# Altium project BusinessCard.PrjPcb
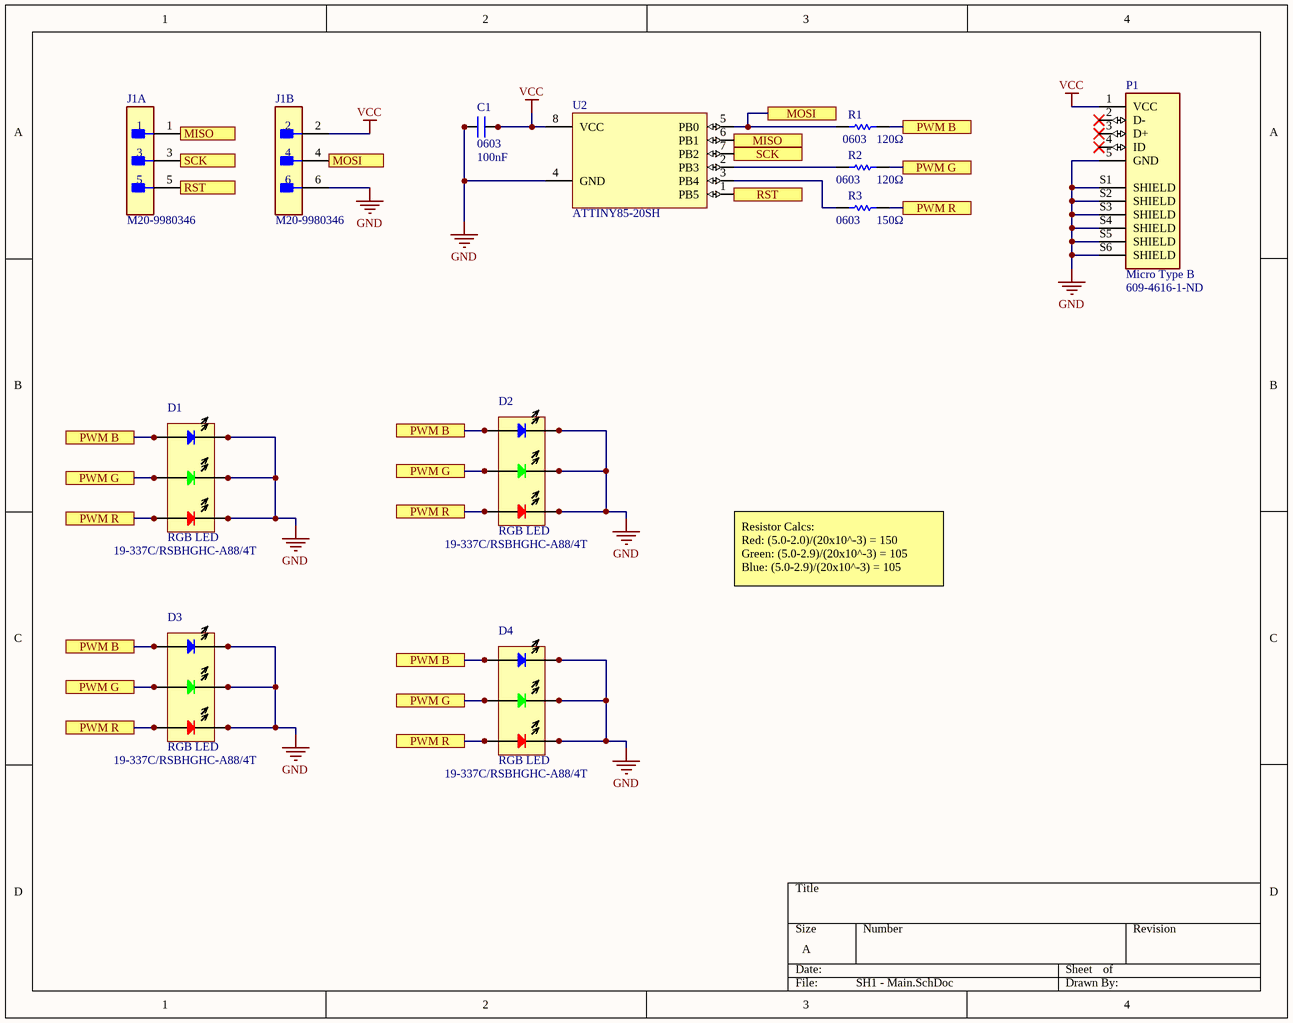
[diagram p0: SH1 - Main.SchDoc]
1 sheet, 11 parts. Net scope: flat (ports and power ports of the same name join across sheets).
Board file: PCB.PcbDoc

## Sheet SH1 - Main.SchDoc
size A; SheetNumber: 1; SheetTotal: 1

### Parts
C1  0603  Capacitance: 100nF  [0603]
D1  RGB LED  [19-337C/RSBHGHC-A88/4T]
D2  RGB LED  [19-337C/RSBHGHC-A88/4T]
D3  RGB LED  [19-337C/RSBHGHC-A88/4T]
D4  RGB LED  [19-337C/RSBHGHC-A88/4T]
J1  M20-9980346  [FP-M20-9980346-MFG]  (parts A,B of 2)
P1  Micro Type B  Supplier Part Number 1: 609-4616-1-ND  [FCI_10118193-0001LF]
R1  0603  Resistance: 120Ω  [SDR03EZPJ200]
R2  0603  Resistance: 120Ω  [SDR03EZPJ200]
R3  0603  Resistance: 150Ω  [0603]
U2  Manufacturer Part Number: ATTINY85-20SH  [SOIC127P798X216-8N]  (hidden comment: ATTiny85)

### Ports
MISO, MOSI, PWM B, PWM G, PWM R, RST, SCK

### Nets
GND: C1.1 D1.1(GREEN_-) D1.3(RED_-) D1.5(BLUE_-) D2.1(GREEN_-) D2.3(RED_-) D2.5(BLUE_-) D3.1(GREEN_-) D3.3(RED_-) D3.5(BLUE_-) D4.1(GREEN_-) D4.3(RED_-) D4.5(BLUE_-) J1.6 P1.5(GND) P1.S1(SHIELD) P1.S2(SHIELD) P1.S3(SHIELD) P1.S4(SHIELD) P1.S5(SHIELD) P1.S6(SHIELD) U2.4(GND)
VCC: C1.2 J1.2 P1.1(VCC) U2.8(VCC)
NetD1_2: D1.2(Green_+) D2.2(Green_+) D3.2(Green_+) D4.2(Green_+) R2.2 ; port PWM G
NetD1_4: D1.4(Red_+) D2.4(Red_+) D3.4(Red_+) D4.4(Red_+) R3.2 ; port PWM R
NetD1_6: D1.6(Blue_+) D2.6(Blue_+) D3.6(Blue_+) D4.6(Blue_+) R1.2 ; port PWM B
NetJ1_1: J1.1 U2.6(PB1) ; port MISO
NetJ1_3: J1.3 U2.7(PB2) ; port SCK
NetJ1_4: J1.4 R1.1 U2.5(PB0) ; port MOSI
NetJ1_5: J1.5 U2.1(PB5) ; port RST
NetR2_1: R2.1 U2.2(PB3)
NetR3_1: R3.1 U2.3(PB4)

Not connected (* = marked no-connect by the designer): P1 2(D-)* 3(D+)* 4(ID)*

### Notes on the sheet
- Resistor Calcs:
  Red: (5.0-2.0)/(20x10^-3) = 150
  Green: (5.0-2.9)/(20x10^-3) = 105
  Blue: (5.0-2.9)/(20x10^-3) = 105

### Library data of the parts
C1 = CAP 0.1uF: Ceramic Capacitor, Multilayer, Ceramic, 16V, 10% +Tol, 10% -Tol, X5R, 15% TC, 0.1uF, Surface Mount, 0603; Manufacturer: Taiyo Yuden; Manufacturer Part Number: EMK107BJ104KAHT; Multilayer: Yes; Reference Standard: AEC-Q200; Supplier 1: Digi-Key; RoHS: Yes; Category: Ceramic Capacitors; Stock 1: 65712; Mount: Surface Mount; Number of Pins: 2; Dielectric Material: Ceramic; Package Shape: Rectangular; Size Code: 0603; Min Operating Temperature: -55°C; Max Operating Temperature: 85°C; Capacitor Type: Ceramic; Negative Tolerance: 10%; Package Style: SMTMeter; Packaging: Tape and Reel; Positive Tolerance: 10%; Rated DC Voltage (URdc): 16V; Temperature Characteristics Code: X5R; Termination: Wraparound; Length: 1.6mm; Width: 0.8mm; Height: 0.8mm; ComponentLink1URL: https://datasheet.ciiva.com:443/pdfs/VipMasterIC/IC/TAIY/TAIY-S-A0009098652/TAIY-S-A0009098054-1.pdf?src-supplier=IHS+Markit; ComponentLink1Description: https://datasheet.ciiva.com:443/pdfs/VipMasterIC/IC/TAIY/TAIY-S-A0009098652/TAIY-S-A0009098054-1.pdf?src-supplier=IHS+Markit; ComponentLink2URL: http://www.mouser.com/ds/2/396/mlcc11_hq_e-541564.pdf?src-supplier=Mouser; ComponentLink2Description: http://www.mouser.com/ds/2/396/mlcc11_hq_e-541564.pdf?src-supplier=Mouser; ComponentLink3URL: http://ds.yuden.co.jp/TYCOMPAS/ut/detail.do?productNo=EMK107BJ104KAHT&fileName=EMK107BJ104KAHT_SS&mode=specSheetDownload&src-supplier=Digi-Key; ComponentLink3Description: http://ds.yuden.co.jp/TYCOMPAS/ut/detail.do?productNo=EMK107BJ104KAHT&fileName=EMK107BJ104KAHT_SS&mode=specSheetDownload&src-supplier=Digi-Key; ComponentLink4URL: http://www.yuden.co.jp/ut/product/category/capacitor/putpdf/EMK107BJ104KAHT.pdf?src-supplier=Avnet; ComponentLink4Description: http://www.yuden.co.jp/ut/product/category/capacitor/putpdf/EMK107BJ104KAHT.pdf?src-supplier=Avnet; Supplier Part Number 1: 587-3308-1-ND
D1-D4 = LED_RGB: Tri Color Pcb Top View SMD Led R; Manufacturer: Everlight; Supplier 1: Digi-Key; RoHS: No; Category: LEDs; Stock 1: 109225; Pricing 1: 1=0.40000, 10=0.24400, 100=0.14030, 1000=0.10980, 2000=0.10065 (USD); Supplier Part Number 1: 1080-1631-1-ND; Manufacturer Part Number: 19-337C/RSBHGHC-A88/4T
J1 = CMP-2000-06636-2: CONN HEADER VERT 6POS 2.54MM; Manufacturer: Harwin; Current Rating: 3A; Number Of Contacts: 6; Conn Gender: Male; Conn Orientation: Vertical; Device Class L1: Connectors; ComponentLink2Description: Datasheet; Height: 8.99mm; Temperature Range High: +105°C; Contact Material: Tin,Nickel; RoHS: TRUE; Temperature Range Low: -40°C; ComponentLink2URL: https://cdn.harwin.com/pdfs/M20-998.pdf; Digikey Description: CONN HEADER VERT 6POS 2.54MM; Pitch: 2.54mm; Package: M20-9980346; Device Class L2: Headers and Wire Housings; Manufacturer Part Number: M20-9980346; Number Of Rows: 2; Category: Conn; Lead Free: Yes; Mouser Description: 2.54mm (0.1") Pitch DIL Vertical PC Tail Pin Header, 6.1mm mating pin height, tin, 3+3 contacts; Temperature: -40°C to +105°C; Device Class L3: unset; Octopart: https://octopart.com/m20-9980346-harwin-5436545; Automotive: No
P1 = USB Connector: USB Connector, 5 Contact(s), Female, Right Angle, Solder Terminal, Locking, Receptacle; Manufacturer: Amphenol FCI; Manufacturer Part Number: 10118193-0001LF; Manufacturer Series: 10118193; Contact Resistance: 30mR; Durability: 10000Cycles; Empty Shell: No; Insertion Force-Max: 35.1392N; Insulation Resistance: 1GR; Mating Information: MULTIPLE MATING PARTS AVAILABLE; Number Of Connectors: 1; PCB Contact Pattern: RECTANGULAR; Polarization Key: POLAR PIN POSITION; Rated Current (Signal): 1.8A; Number of Contacts: 5; Connector Type: TELECOM AND DATACOM CONNECTOR; Option: General Purpose; Board Mounting Option: LOCATING POSTS; Plating Thickness: 30uin; Body Breadth: 0.122inch; Body Depth: 0.199inch; Body Length: 0.309inch; Reference Standard: UL; Reliability: COMMERCIAL; Supplier 1: Digi-Key; RoHS: Yes; Category: USB Connectors; Stock 1: 43659; Pricing 1: 1=0.45000, 10=0.43000, 25=0.36840, 50=0.31320, 100=0.30090, 250=0.27016, 500=0.25788 (USD); Mount: Board; Insulation Material: Polymer; Shell Finish: Tin; Shell Material: Stainless Steel; Contact Material: Copper Alloy; Contact Finish - Mating: GOLD (30) OVER NICKEL; Contact Finish - Termination: GOLD FLASH OVER NICKEL; Contact Gender: Female; Contact Style: USB; Filter Feature: No; Mixed Contacts: No; Mounting Style: RIGHT ANGLE; Number Of PCB Rows: 1; Termination: Solder; JESD-609 Code: e4; Body/Shell Style: RECEPTACLE; Mounting Option 1: LOCKING; Terminal Pitch: 0.6604mm; Flammability Rating: UL94 V-0; DIN Conformance: No; IEC Conformance: No; MIL Conformance: No; ComponentLink1URL: https://datasheet.ciiva.com:443/pdfs/VipMasterIC/IC/FRCI/FRCI-S-A0000088532/FRCI-S-A0001133856-1.pdf?src-supplier=IHS+Markit; ComponentLink1Description: https://datasheet.ciiva.com:443/pdfs/VipMasterIC/IC/FRCI/FRCI-S-A0000088532/FRCI-S-A0001133856-1.pdf?src-supplier=IHS+Markit; ComponentLink2URL: https://datasheet.ciiva.com/851/10118193-851106.pdf?src-supplier=Digi-Key; ComponentLink2Description: https://datasheet.ciiva.com/851/10118193-851106.pdf?src-supplier=Digi-Key; ComponentLink3URL: https://datasheet.ciiva.com/26853/getdatasheetpartid-418618-26853893.pdf?src-supplier=Verical; ComponentLink3Description: https://datasheet.ciiva.com/26853/getdatasheetpartid-418618-26853893.pdf?src-supplier=Verical; ComponentLink4URL: https://datasheet.ciiva.com/4598/10118193ac-197151-4598799.pdf?src-supplier=Mouser; ComponentLink4Description: https://datasheet.ciiva.com/4598/10118193ac-197151-4598799.pdf?src-supplier=Mouser; ComponentLink5URL: https://datasheet.ciiva.com/14802/10118193-0001lf-webpage-14802386.pdf?src-supplier=Arrow+Electronics; ComponentLink5Description: https://datasheet.ciiva.com/14802/10118193-0001lf-webpage-14802386.pdf?src-supplier=Arrow+Electronics; ComponentLink6URL: https://datasheet.ciiva.com/851/10118193-851107.pdf?src-supplier=Digi-Key; ComponentLink6Description: https://datasheet.ciiva.com/851/10118193-851107.pdf?src-supplier=Digi-Key; ComponentLink7URL: https://datasheet.ciiva.com/851/10118193-851108.pdf?src-supplier=Digi-Key; ComponentLink7Description: https://datasheet.ciiva.com/851/10118193-851108.pdf?src-supplier=Digi-Key; ComponentLink8URL: https://datasheet.ciiva.com/14618/70236827-14618887.pdf?src-supplier=Allied+Electronics; ComponentLink8Description: https://datasheet.ciiva.com/14618/70236827-14618887.pdf?src-supplier=Allied+Electronics
R1 R2 = RES 120Ω: Fixed Resistor, 0.1W, 120ohm, 50V, 5% +/-Tol, 200ppm/Cel, Surface Mount, 0603; Manufacturer: Rohm; Manufacturer Part Number: SDR03EZPJ121; Supplier 1: Digi-Key; RoHS: No; Category: Chip SMD Resistors; Stock 1: 4798; Pricing 1: 1=0.10000, 10=0.07300, 100=0.02800, 1000=0.01232, 2500=0.01064 (USD); ComponentLink1URL: https://datasheet.ciiva.com:443/pdfs/VipMasterIC/IC/ROHM/ROHM-S-A0002832543/ROHM-S-A0002832543-1.pdf?src-supplier=IHS+Markit; ComponentLink1Description: https://datasheet.ciiva.com:443/pdfs/VipMasterIC/IC/ROHM/ROHM-S-A0002832543/ROHM-S-A0002832543-1.pdf?src-supplier=IHS+Markit; ComponentLink2URL: https://www.rohm.com/datasheet/SDR03EZPJ/sdr-e?src-supplier=Digi-Key; ComponentLink2Description: https://www.rohm.com/datasheet/SDR03EZPJ/sdr-e?src-supplier=Digi-Key; Supplier Part Number 1: 511-1735-1-ND
R3 = RES 150Ω: Fixed Resistor, Metal Glaze/thick Film, 0.1W, 150ohm, 75V, 5% +/-Tol, 200ppm/Cel, Surface Mount, 0603; Manufacturer: Vishay; Manufacturer Part Number: CRCW0603150RJNEAC; Rated Power Dissipation (P): 100mW; Temperature Coefficient: -200200ppm/°C; Package Height: 0.45mm; Package Length: 1.6mm; Package Width: 0.8mm; Supplier 1: Digi-Key; RoHS: Yes; Category: Chip SMD Resistors; Stock 1: 59770; Number of Pins: 2; Size Code: 0603; Terminal Finish: Nickel; Min Operating Temperature: -55°C; Max Operating Temperature: 155°C; Tolerance: 5%; JESD-609 Code: e3; Resistor Type: FIXED RESISTOR; Construction: Chip; Package Style: SMTMeter; Packaging: Tape and Reel; Technology: METAL GLAZE/THICK FILM; Working Voltage: 75V; ComponentLink1URL: https://datasheet.ciiva.com:443/pdfs/VipMasterIC/IC/VISH/VISH-S-A0003599164/VISH-S-A0003599164-1.pdf?src-supplier=IHS+Markit; ComponentLink1Description: https://datasheet.ciiva.com:443/pdfs/VipMasterIC/IC/VISH/VISH-S-A0003599164/VISH-S-A0003599164-1.pdf?src-supplier=IHS+Markit; ComponentLink2URL: http://www.vishay.com/docs/28773/crcwce3.pdf?src-supplier=Digi-Key; ComponentLink2Description: http://www.vishay.com/docs/28773/crcwce3.pdf?src-supplier=Digi-Key; Supplier Part Number 1: 541-CRCW0603150RJNEACCT-ND
U2 = ATTiny85: RISC Microcontroller, 8-Bit, FLASH, AVR RISC CPU, 20MHz, CMOS, PDSO8; Manufacturer: Microchip / Atmel; Package Body Material: Plastic; Number of I/O Lines: 6; Package Equivalence Code: SOP8,.3; Power Supplies: 3/5V; Speed: 20RPM; Max Supply Current: 8mA; Max Supply Voltage: 5.5V; Min Supply Voltage: 4.5V; Supply Voltage-Nom: 5V; Qualification Status: Not Qualified; Supplier 1: Digi-Key; RoHS: Yes; Category: Microcontrollers; Stock 1: 1154; Package Code: SOP; Number of Pins: 8; Package Shape: Rectangular; Min Operating Temperature: -40°C; Max Operating Temperature: 85°C; Max Frequency: 20MHz; JESD-30 Code: R-PDSO-G8; Package Style: SMALL OUTLINEMeter; Surface Mount: Yes; Technology: CMOS; Terminal Form: Gull Wing; Terminal Position: DUAL; Length: 5.29mm; Width: 5.24mm; Height - Seated (Max): 2.16mm; Terminal Pitch: 1.27mm; Temperature Grade: INDUSTRIAL; ComponentLink1URL: https://datasheet.ciiva.com:443/pdfs/VipMasterIC/IC/ATML/ATMLS09344/ATMLS09344-1.pdf?src-supplier=IHS+Markit; ComponentLink1Description: https://datasheet.ciiva.com:443/pdfs/VipMasterIC/IC/ATML/ATMLS09344/ATMLS09344-1.pdf?src-supplier=IHS+Markit; ComponentLink2URL: https://datasheet.ciiva.com/9235/doc2586-9235500.pdf?src-supplier=Avnet; ComponentLink2Description: https://datasheet.ciiva.com/9235/doc2586-9235500.pdf?src-supplier=Avnet; Supplier Part Number 1: ATTINY85-20SH-ND